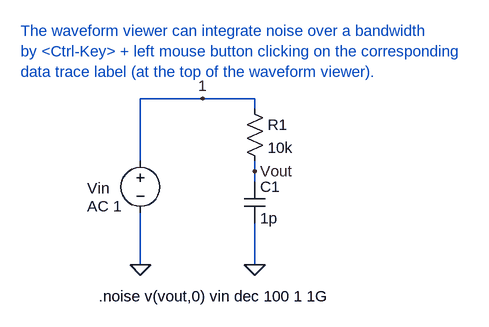
[diagram p0: schematic Ex8_6.asc]
Ex8_6.asc, the LTspice schematic file:
Version 4
SHEET 1 1072 704
WIRE 224 240 224 144
WIRE 224 400 224 320
WIRE 320 144 224 144
WIRE 400 144 320 144
WIRE 400 160 400 144
WIRE 400 256 400 240
WIRE 400 272 400 256
WIRE 400 400 400 336
FLAG 400 400 0
FLAG 224 400 0
FLAG 320 144 1
FLAG 400 256 Vout
SYMBOL res 384 144 R0
SYMATTR InstName R1
SYMATTR Value 10k
SYMBOL voltage 224 224 R0
WINDOW 0 -82 58 Left 0
WINDOW 3 24 104 Invisible 0
WINDOW 123 -82 86 Left 0
WINDOW 39 0 0 Left 0
SYMATTR InstName Vin
SYMATTR Value 0
SYMATTR Value2 AC 1
SYMBOL cap 384 272 R0
SYMATTR InstName C1
SYMATTR Value 1p
TEXT 160 448 Left 0 !.noise v(vout,0) vin dec 100 1 1G
TEXT 40 40 Left 0 ;The waveform viewer can integrate noise over a bandwidth \nby <Ctrl-Key> + left mouse button clicking on the corresponding \ndata trace label (at the top of the waveform viewer).

The netlist it stands for:
* Ex8_6.asc
R1 1 Vout 10k
Vin 1 0 0 AC 1
C1 Vout 0 1p
.noise v(vout,0) vin dec 100 1 1G
* The waveform viewer can integrate noise over a bandwidth
* by <Ctrl-Key> + left mouse button clicking on the corresponding
* data trace label (at the top of the waveform viewer).
.backanno
.end